# EAGLE design Atomic_Stick (EAGLE 9.6.2)
Assembly variants: ECU Type I non terminated

## Sheet 1 of 3
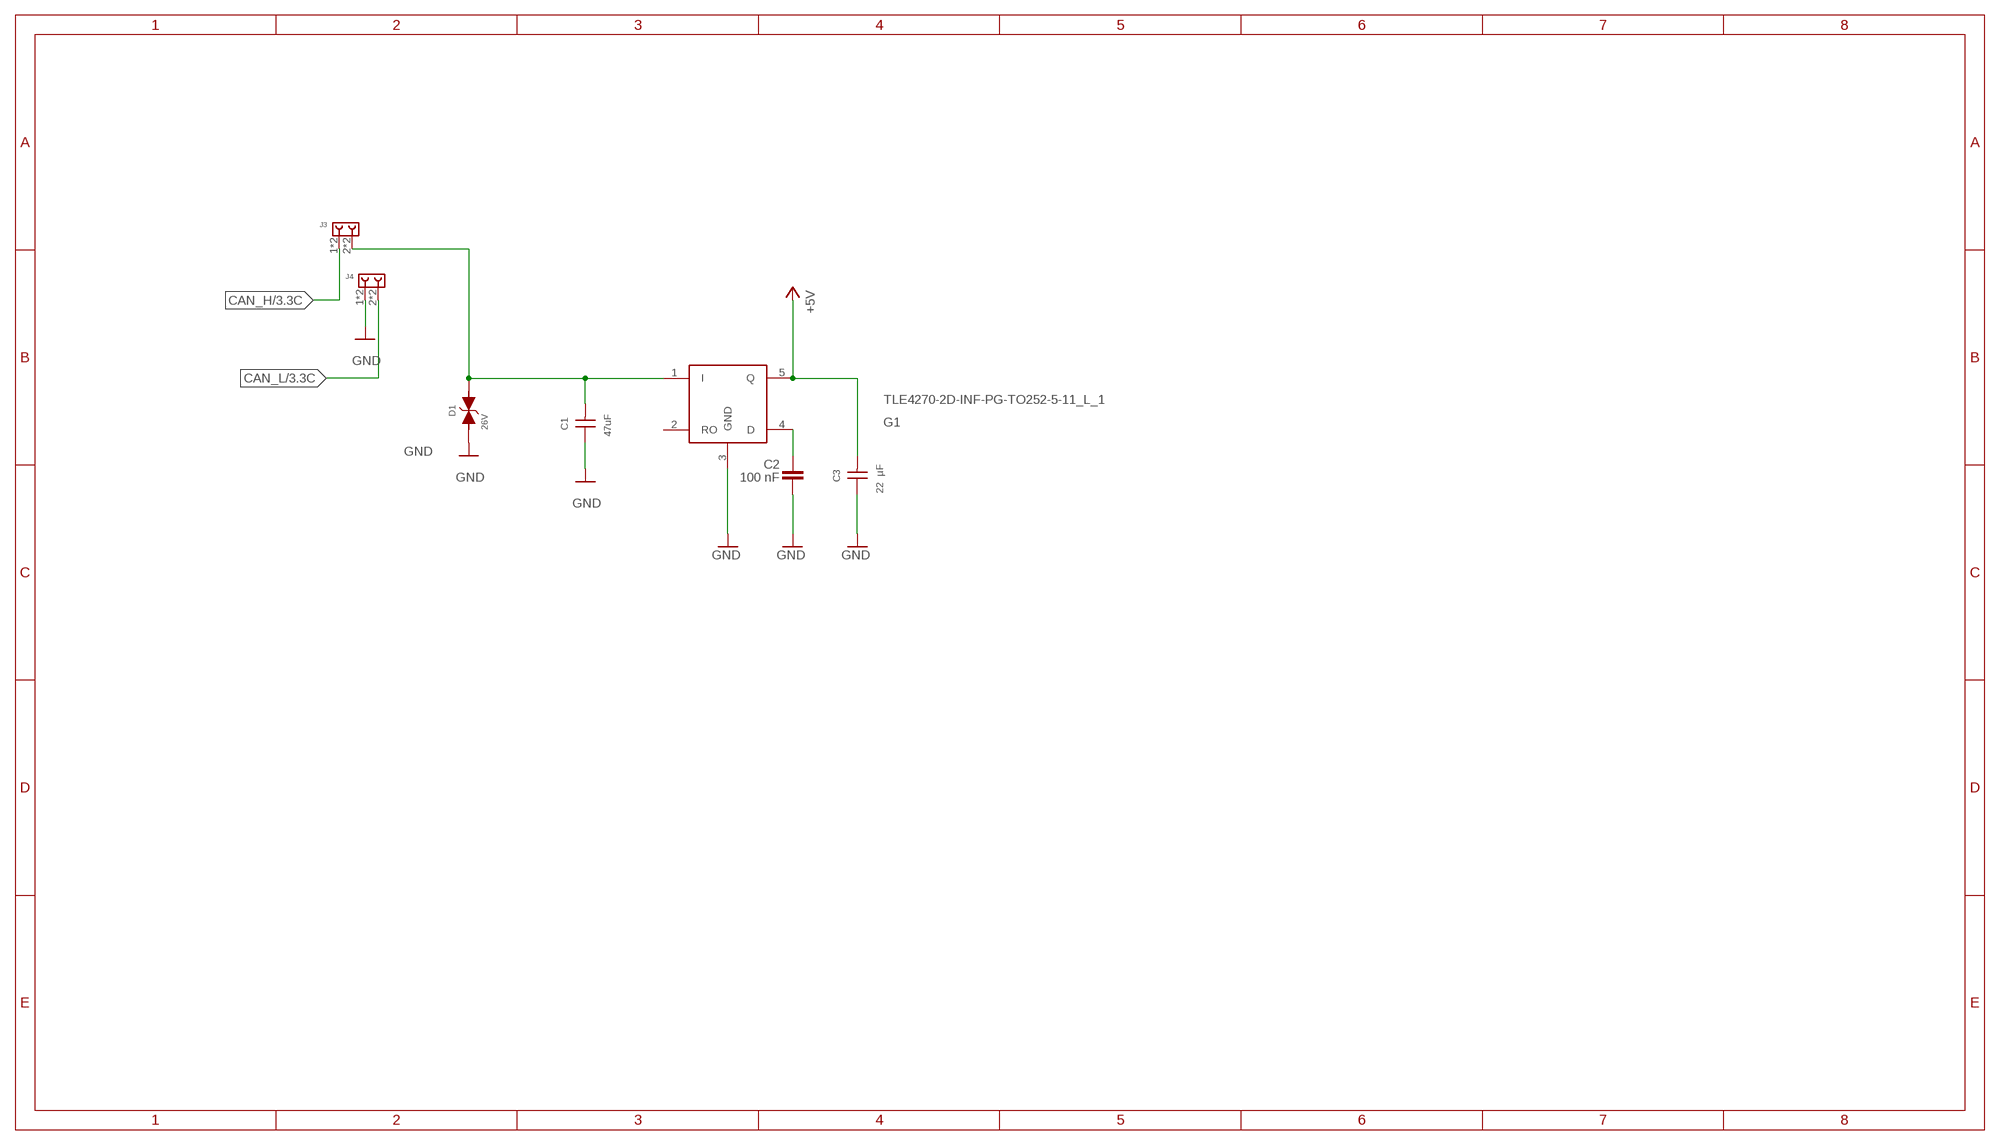
[diagram p0: schematic, sheet 1]

### Parts
C1  47uF  WCAP-CSGP_1210_H2.5_885012109014_25V(DC)  [WCAP-CSGP_1210_H2.5]
C2  100 nF  WCAP-CSGP_0402_885012205037_16V(DC)  [WCAP-CSGP_0402]
C3  22 µF  WCAP-CSGP_0805_H1.25_885012107011_10V(DC)  [WCAP-CSGP_0805_H1.25_R]
D1  26V  WE-TVSP_DO-214AC_400W_BI_824501261  [WE-TVSP_DO-214AC_BIDIRECTIONAL]
G1  TLE4270-2D-INF-PG-TO252-5-11_L_1  [INF-PG-TO252-5-11_L_1PRIMARY]
J3  695402400222  [695402400222]
J4  695402400222  [695402400222]

### Nets
+5V: C3.2 G1.5(Q) ; also sheet 2,3
+12V: C1.2 D1.2 G1.1(I) J3.2 J3.A2
CAN_H: J3.1 J3.A1 ; also sheet 3
CAN_L: J4.2 J4.A2 ; also sheet 3
GND [GND]: C1.1 C2.2 C3.1 D1.1 G1.3(GND) J4.1 J4.A1 ; also sheet 2,3
N$1: C2.1 G1.4(D)
Unconnected: G1.2(RO)

## Sheet 2 of 3
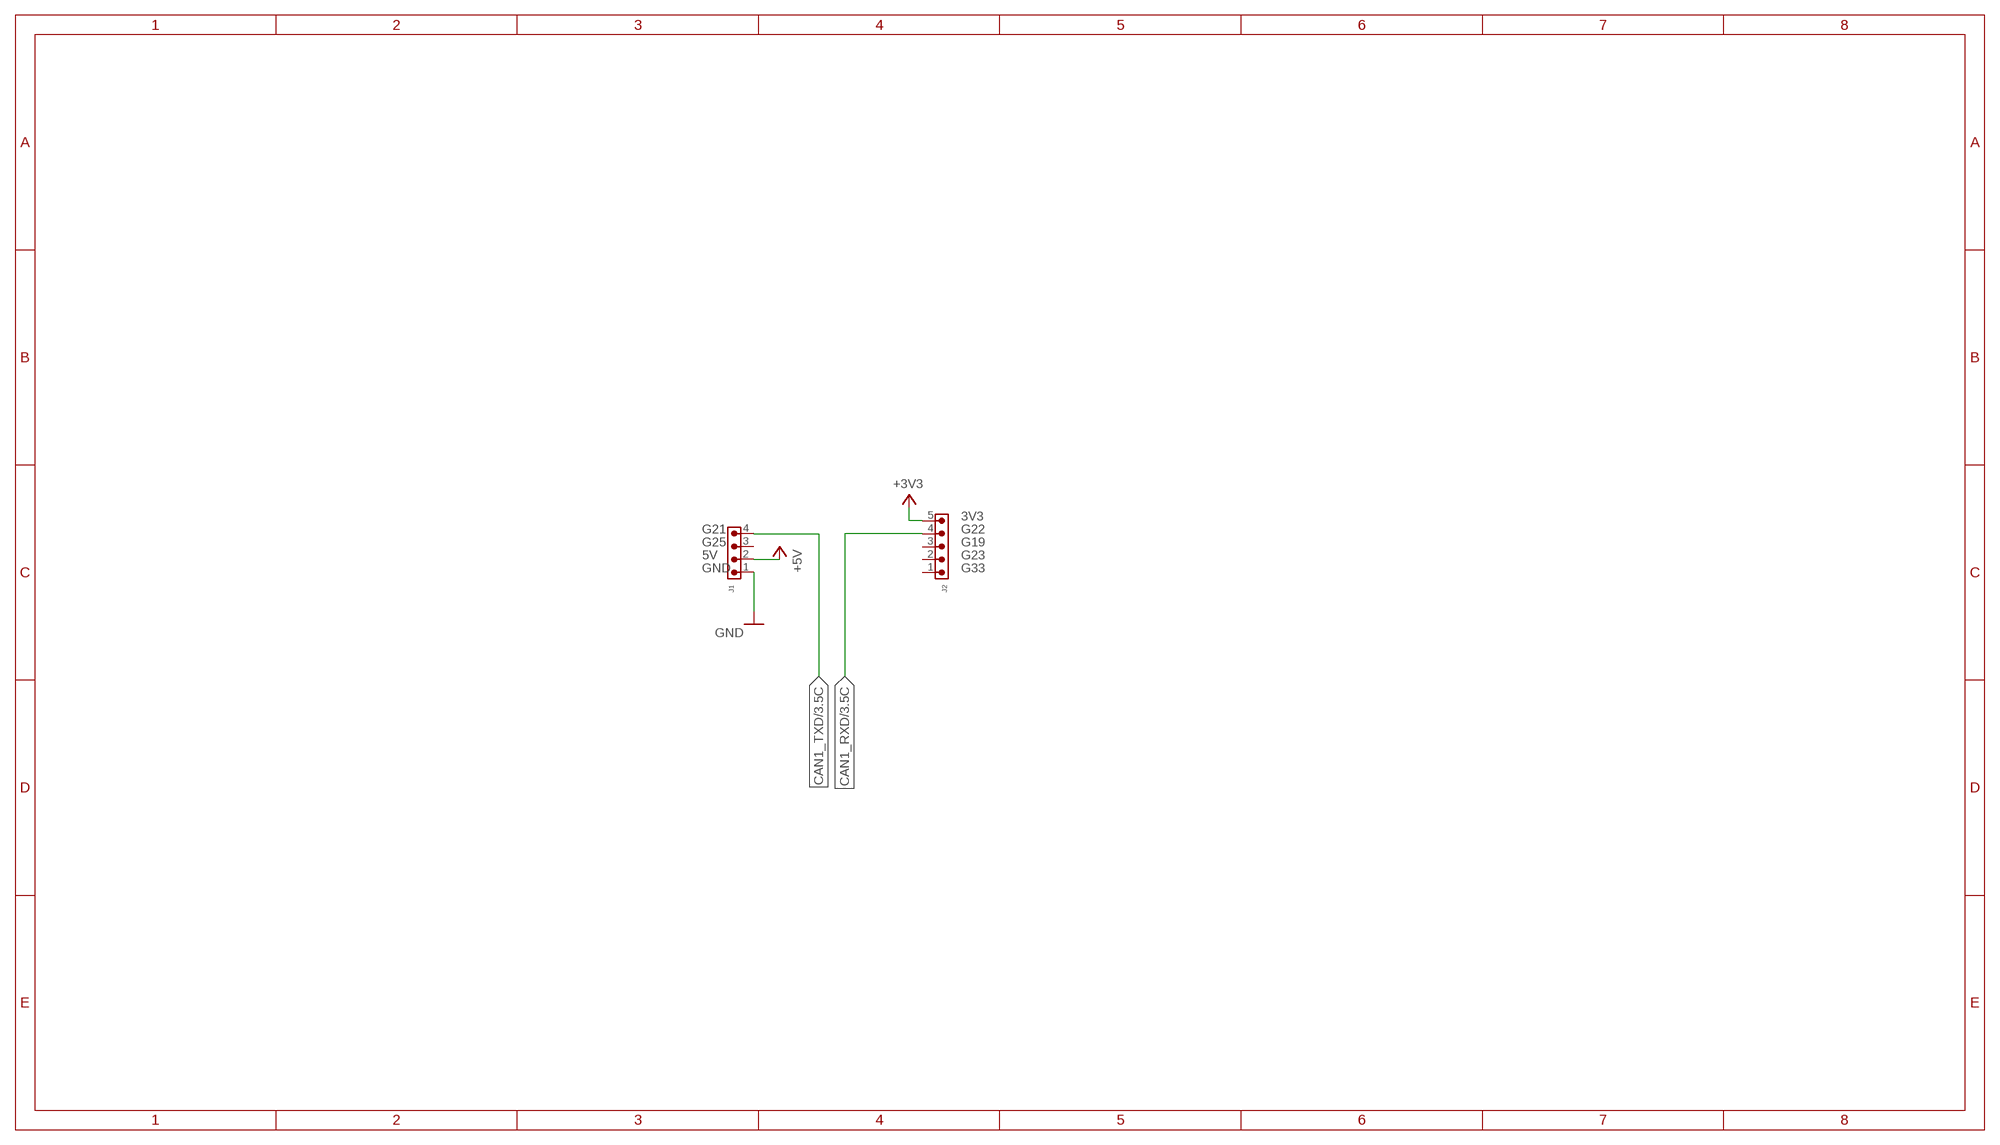
[diagram p1: schematic, sheet 2]

### Parts
J1  6130XX11121_61300411121  [61300411121]
J2  6130XX11121_61300511121  [61300511121]

### Nets
+3V3: J2.5 ; also sheet 3
+5V: J1.2 ; also sheet 1,3
CAN1_RXD: J2.4 ; also sheet 3
CAN1_TXD: J1.4 ; also sheet 3
GND [GND]: J1.1 ; also sheet 1,3
Unconnected: J1.3 J2.1 J2.2 J2.3

### Notes on the sheet
- 3V3
- G21 | G22
- G25 | G19
- 5V | G23
- GND | G33

## Sheet 3 of 3
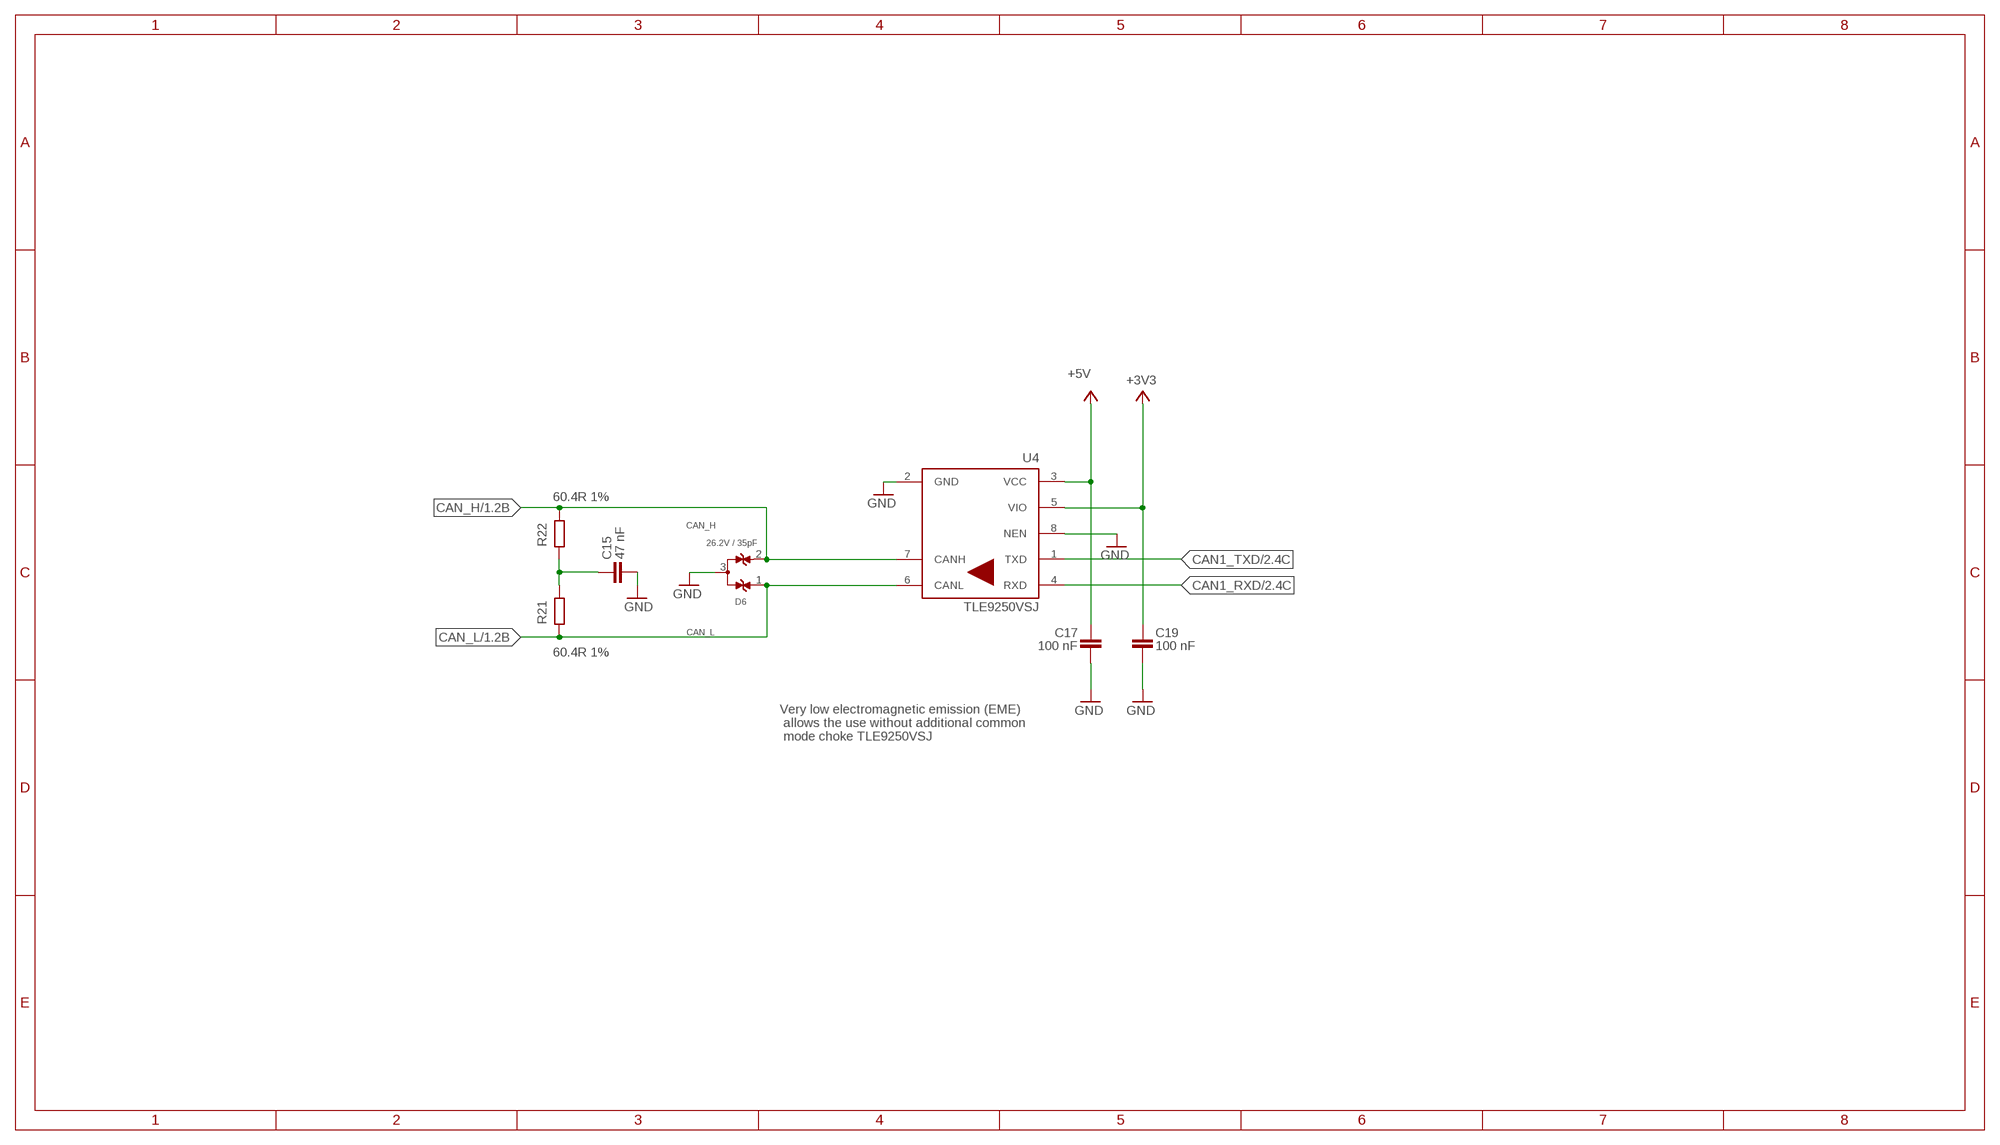
[diagram p2: schematic, sheet 3]

### Parts
C15  47 nF  WCAP-CSGP_0402_885012205054_25V(DC)  [WCAP-CSGP_0402]
C17  100 nF  WCAP-CSGP_0402_885012205037_16V(DC)  [WCAP-CSGP_0402]
C19  100 nF  WCAP-CSGP_0402_885012205037_16V(DC)  [WCAP-CSGP_0402]
D6  26.2V / 35pF  WE-TVS_SOT23-3L_824098024  [WE-TVS_SOT23-3L]
R21  60.4R 1%  R-0402_60.4OHMS_1%_AEC-Q200  [WCAP-CSRF_0402]  (not fitted in variant ECU Type I non terminated)
R22  60.4R 1%  R-0402_60.4OHMS_1%_AEC-Q200  [WCAP-CSRF_0402]  (not fitted in variant ECU Type I non terminated)
U4  TLE9250VSJ  [SOIC127P602X173-8N-V]

### Nets
+3V3: C19.1 U4.5(VIO) ; also sheet 2
+5V: C17.1 U4.3(VCC) ; also sheet 1,2
CAN1_RXD: U4.4(RXD) ; also sheet 2
CAN1_TXD: U4.1(TXD) ; also sheet 2
CAN_H: D6.2 R22.2 U4.7(CANH) ; also sheet 1
CAN_L: D6.1 R21.1 U4.6(CANL) ; also sheet 1
GND [GND]: C15.2 C17.2 C19.2 D6.3 U4.2(GND) U4.8(NEN) ; also sheet 1,2
N$17: C15.1 R21.2 R22.1

### Notes on the sheet
- Very low electromagnetic emission (EME)
   allows the use without additional common
   mode choke TLE9250VSJ

## Library data of the parts
C1 = Wurth_Capacitors_WCAP-CSGP:WCAP-CSGP_1210_H2.5: WCAP-CSGP MLCCs 1210 General Purpose Characteristics General purpose product series High performance ceramic High electrical precision and stability ceramic especially for NP0 Minimal aging especially for NP0 Mounting style: SMT-Chip Ceramic: NP0 (Class I), X5R (Class II), X7R (Class II) Capacitance range: 22 pF ‒ 100 µF Temperature Coefficient: ±30 ppm/°C; ±0.54 % for NP0 ±15 % for X7R and X5R Voltage range (UR): 6.3 ‒ 100 V(DC) Operating temperature: -55 °C up to + 125 °C for NP0 and X7R -55 °C up to + 85 °C for X5R Termination: Cu/Ni/Sn Recommended soldering: Reflow soldering Applications Temperature compensation (NP0) Coupling Decoupling Bypass Smoothing Filtering Resonant circuit <https://www.we-online.com/catalog/media/o166502v209%20Family_WE-MLCC_1210.jpg> Details see: https://www.we-online.com/catalog/en/WCAP-CSGP-1210/ Updated by yingchun,Shan;2020-03-09 2020(C) Würth Elektronik; CERAMIC-TYPE: X5R Class II; DATASHEET-URL: https://www.we-online.com/catalog/datasheet/885012109014.pdf; DF: 0.05; H: 2.5mm; OPERATING-TEMPERATURE: -55 °C up to +85 °C; PART-NUMBER: 885012109014; QMIN: -; RISO: 0,005G Ohm; TECHNICAL-REFERENCE: X5R1210226M025DFCT10000; TOL-VALUE: ±20%; VALUE: 22µF; VR: 25V(DC)
C2 C17 C19 = fliegl-wuerth:WCAP-CSGP_0402: WCAP-CSGP MLCCs 0402 General Purpose Characteristics High performance ceramic High electrical precision and stability ceramic especially for NP0 Minimal aging especially for NP0 Mounting style: SMT-Chip Ceramic: NP0 (Class I), X5R (Class II), X7R (Class II) Capacitance range: 1 pF ‒ 10 µF Temperature Coefficient: ±30 ppm/°C; ±0.54 % for NP0 ±15 % for X5R and X7R Voltage range (UR): 6.3 ‒ 100 V(DC) Operating temperature: -55 °C up to + 125 °C for NP0 and X7R -55 °C up to + 85 °C for X5R Termination: Cu/Ni/Sn Recommended soldering: Reflow soldering Applications Temperature compensation (NP0) Coupling Decoupling Bypass Smoothing Filtering Resonant circuit <https://www.we-online.com/catalog/media/o157810v209%20Family_WE-MLCC_0805_weiss.jpg> Details see: https://www.we-online.com/catalog/en/WCAP-CSGP-0402/ Updated by yingchun,Shan;2020-03-06 2020(C) Würth Elektronik; ARTIKEL_NR: 545504; CERAMIC-TYPE: X7R Class II; PART-NUMBER: 885012205037; TOL-VALUE: ±10%; VR: 16V(DC)
C3 = Wurth_Capacitors_WCAP-CSGP:WCAP-CSGP_0805_H1.25: WCAP-CSGP MLCCs 0805 General Purpose Characteristics General purpose product series High performance ceramic High electrical precision and stability ceramic especially for NP0 Minimal aging especially for NP0 Mounting style: SMT-Chip Ceramic: NP0 (Class I), X5R (Class II), X7R (Class II) Capacitance range: 1 pF ‒ 47 μF Temperature Coefficient: ±30 ppm/°C; ±0.54 % for NP0 ±15 % for X7R and X5R Voltage range (UR): 6.3 ‒ 100 V(DC) Operating temperature: -55 °C up to + 125 °C for NP0 and X7R -55 °C up to + 85 °C for X5R Termination: Cu/Ni/Sn Recommended soldering: Reflow soldering Wave soldering (only valid for the thickness ≤1.00 mm) for NP0 and X7R Applications TTemperature compensation (NP0) Coupling Decoupling Bypass Smoothing Filtering Resonant circuit <https://www.we-online.com/catalog/media/o166500v209%20Family_WE-MLCC_0805_grau.jpg> Details see: https://www.we-online.com/catalog/en/WCAP-CSGP-0805/ Updated by yingchun,Shan;2020-03-09 2020(C) Würth Elektronik; CERAMIC-TYPE: X5R Class II; DATASHEET-URL: https://www.we-online.com/catalog/datasheet/885012107011.pdf; DF: 0.1; H: 1.25mm; OPERATING-TEMPERATURE: -55 °C up to +85 °C; PART-NUMBER: 885012107011; QMIN: -; RISO: 0,005GOhm; TECHNICAL-REFERENCE: X5R0805226M010DFCT10000; TOL-VALUE: ±20%; VR: 10V(DC)
C15 = fliegl-wuerth:WCAP-CSGP_0402: WCAP-CSGP MLCCs 0402 General Purpose Characteristics High performance ceramic High electrical precision and stability ceramic especially for NP0 Minimal aging especially for NP0 Mounting style: SMT-Chip Ceramic: NP0 (Class I), X5R (Class II), X7R (Class II) Capacitance range: 1 pF ‒ 10 µF Temperature Coefficient: ±30 ppm/°C; ±0.54 % for NP0 ±15 % for X5R and X7R Voltage range (UR): 6.3 ‒ 100 V(DC) Operating temperature: -55 °C up to + 125 °C for NP0 and X7R -55 °C up to + 85 °C for X5R Termination: Cu/Ni/Sn Recommended soldering: Reflow soldering Applications Temperature compensation (NP0) Coupling Decoupling Bypass Smoothing Filtering Resonant circuit <https://www.we-online.com/catalog/media/o157810v209%20Family_WE-MLCC_0805_weiss.jpg> Details see: https://www.we-online.com/catalog/en/WCAP-CSGP-0402/ Updated by yingchun,Shan;2020-03-06 2020(C) Würth Elektronik; ARTIKEL_NR: 545508; CERAMIC-TYPE: X7R Class II; PART-NUMBER: 885012205054; TOL-VALUE: ±10%; VR: 25V(DC)
D1 = Wurth_EMC Components_WE-TVSP:WE-TVSP_DO-214AC_400W_BI: WE-TVSP Power TVS Diode Characteristics Low Profile Package Glass passivated Juction Excellent clamping capability Fast response time MSL Level 1, per J-STD-020 Classification of the plastic case: UL 94 V-0 Safety certification UL 497B, E478010 Identical design: - DO-214AC = SMAJ - DO-214AA = SMBJ - DO-214AB = SMCJ/SMDJ Applications Ideal to protect the I/O Interfaces, Bus Voltage and other circuits of sensetive electronic equipment against voltage transiensts <https://katalog.we-online.com/media/images/v2/o55793v209%20WE-TVSP_600W-3000W_D0214AA_4C.jpg> Details see: https://katalog.we-online.com/en/pbs/WE-TVSP Updated by Ella Wu 2019-07-05 2019 (C) Würth Elektronik; DATASHEET-URL: https://katalog.we-online.com/pbs/datasheet/824501261.pdf; IPEAK: 9.5A; MOUNT: SMT; PART-NUMBER: 824501261; PDISS: 400W; VBR: 30.4V; VCLAMP: 42.1V
D6 = fliegl-wuerth:WE-TVS_SOT23-3L_824098024: WE-TVS TVS Diode  Standard Series Characteristics Fast turn-on Low clamping voltage High ESD withstand voltage Uni- or bidirectional protection Small package Epoxy flame resistant UL94 V-0 Applications DC power supply USB Power Delivery (PD) Headsets and accessories PDAs Digital cameras MP3-Player Touch Panels Notebooks ESD, EFT and Surge Protection ESD protection in accordance with EN 61000-4-2  8 kV contact discharge  15 kV air discharge Application Notes ANP024 The USB Interface from EMC Point of View <https://katalog.we-online.de/media/images/v2/Family_WE-TVS_Standard.jpg> Details see: https://katalog.we-online.de/en/pbs/WE-TVS/82402374?m Created By Yingchun,Shan 2018-11-16 2018 (C) Wurth Elektronik; ARTIKEL_NR: 531887; KOMPONENTENNUMMER: 617684; WE-NUMBER: 824098024
G1 = INF-PG-TO252-5-11L:TLE4270-2D-INF-PG-TO252-5-11_L_1
J1 = Wurth_Connectors_WR-PHD:6130XX11121_61300411121: WR-PHD 2.54 mm THT Pin Header ARTICLE PROPERTIES: Pins:1;​ 2;​ 3;​ 4;​ 5;​ 6;​ 7;​ 8;​ 9;​ 10;​ 12;​ 13;​ 14;​ 15;​ 16;​ 18;​ 20;​ 22;​ 24;​ 25;​ 32;​ 36;​ 40 KIND PROPERTIES: Pitch：2.54 mm Quality Class:3 as per CECC 75 301-802 Rows：Single Gender：Pin Header Type：Straight MATERIAL PROPERTIES: Insulator Material :PBT Insulator Flammability Rating:UL94 V-0 Contact Material:Copper Alloy Contact Plating:Gold Contact Type:Stamped GENERAL INFORMATION Operating Temperature:-40 up to +105 °C Compliance:RoHS ELECTRICAL PROPERTIES: Rated Current:3 A IR 1:3 A Withstanding Voltage:500 V (AC) Contact Resistance:20 mΩ RISO:1000 MΩ CERTIFICATION UL Approval:E323964 PACKAGING PROPERTIES Packaging:Bag <https://katalog.we-online.com/media/images/v2/o33211v209%20Family_BTB_PHD_6130xx11121.jpg> Details see: https://katalog.we-online.com/en/em/PHD_2_54_THT_PIN_HEADER_6130XX11121 Updated by Yingchun,Shan 2019-10-16 2019 (C) Würth Elektronik; DATASHEET-URL: https://katalog.we-online.com/em/datasheet/61300411121.pdf; GENDER: Pin Header; IR: 3A; MATES: WR-PHD 2.54mm Angled Socket Header /SMT Socket Header/Socket Header; PACKAGING: Bag; PART-NUMBER: 61300411121; PINS: 4; ROWS: Single; TYPE: Straight
J2 = Wurth_Connectors_WR-PHD:6130XX11121_61300511121: WR-PHD 2.54 mm THT Pin Header ARTICLE PROPERTIES: Pins:1;​ 2;​ 3;​ 4;​ 5;​ 6;​ 7;​ 8;​ 9;​ 10;​ 12;​ 13;​ 14;​ 15;​ 16;​ 18;​ 20;​ 22;​ 24;​ 25;​ 32;​ 36;​ 40 KIND PROPERTIES: Pitch：2.54 mm Quality Class:3 as per CECC 75 301-802 Rows：Single Gender：Pin Header Type：Straight MATERIAL PROPERTIES: Insulator Material :PBT Insulator Flammability Rating:UL94 V-0 Contact Material:Copper Alloy Contact Plating:Gold Contact Type:Stamped GENERAL INFORMATION Operating Temperature:-40 up to +105 °C Compliance:RoHS ELECTRICAL PROPERTIES: Rated Current:3 A IR 1:3 A Withstanding Voltage:500 V (AC) Contact Resistance:20 mΩ RISO:1000 MΩ CERTIFICATION UL Approval:E323964 PACKAGING PROPERTIES Packaging:Bag <https://katalog.we-online.com/media/images/v2/o33211v209%20Family_BTB_PHD_6130xx11121.jpg> Details see: https://katalog.we-online.com/en/em/PHD_2_54_THT_PIN_HEADER_6130XX11121 Updated by Yingchun,Shan 2019-10-16 2019 (C) Würth Elektronik; DATASHEET-URL: https://katalog.we-online.com/em/datasheet/61300511121.pdf; GENDER: Pin Header; IR: 3A; MATES: WR-PHD 2.54mm Angled Socket Header /SMT Socket Header/Socket Header; PACKAGING: Bag; PART-NUMBER: 61300511121; PINS: 5; ROWS: Single; TYPE: Straight
J3 J4 = Wurth_Connectors_WR-LECO:695402400222: WR-LECO 4.00 mm SMT Horizontal Connector CERTIFICATION UL Approval E323964 WIREPROPERTIES Solid Wire Section (AWG) 18 to 24 (AWG) Solid Wire Section (Metric) 0.823 to 0.205 (mm²) Stranded Wire Section (AWG) 18 to 24 (AWG) Stranded Wire Section (Metric) 0.823 to 0.205 (mm²) Wire Strip Length 8 up to 9 (mm) ELECTRICAL PROPERTIES Working Voltage [UL] 250 V (AC) Withstanding Voltage [UL] 1500 V (AC) Contact Resistance [UL] 20 mΩ GENERAL INFORMATION Operating Temperature -35 °C up to +105 °C Compliance Lead free / RoHS IR UL 9 A MATERIAL PROPERTIES Insulator Material PPA-GF Insulator Flammability Rating UL94 V-0 Insulator Color Grey Contact Material Copper Alloy Contact Plating Tin over Nickel KIND PROPERTIES Pitch 4 mm <https://katalog.we-online.com/media/images/v2/o79410v209%20WR-LECO_6954xx400222_4C.jpg> Details see: https://katalog.we-online.com/en/em/LECO_4_00_SMT_WTB_CONNECTOR_HORIZONTAL_6954XX400222 Updated by Ella Wu 2019-10-30 2019(C) Wurth Elektronik; DATASHEET-URL: https://katalog.we-online.com/em/datasheet/695402400222.pdf; GENDER: Wire to Board; IR: 9A; PART-NUMBER: 695402400222; PINS: 2; PITCH: 4mm; TYPE: Angled; WORKING-VOLTAGE: 250V(AC)
R21 R22 = Resistor_smaller_fliegl:R-0402_: RESISTOR, European symbol; ARTIKEL_NR: 546940; N: SMD 0402 60.4ohms 1% AEC-Q200
U4 = TLE9250VSJ:TLE9250VSJ: TLE9250VSJ SOIC127P602X173-8N-V High Speed CAN FD Transceiver; ARTIKEL_NR: 545599

## Net classes
1 GND: width 0.127 mm, clearance 0.127 mm to class 0

## Board
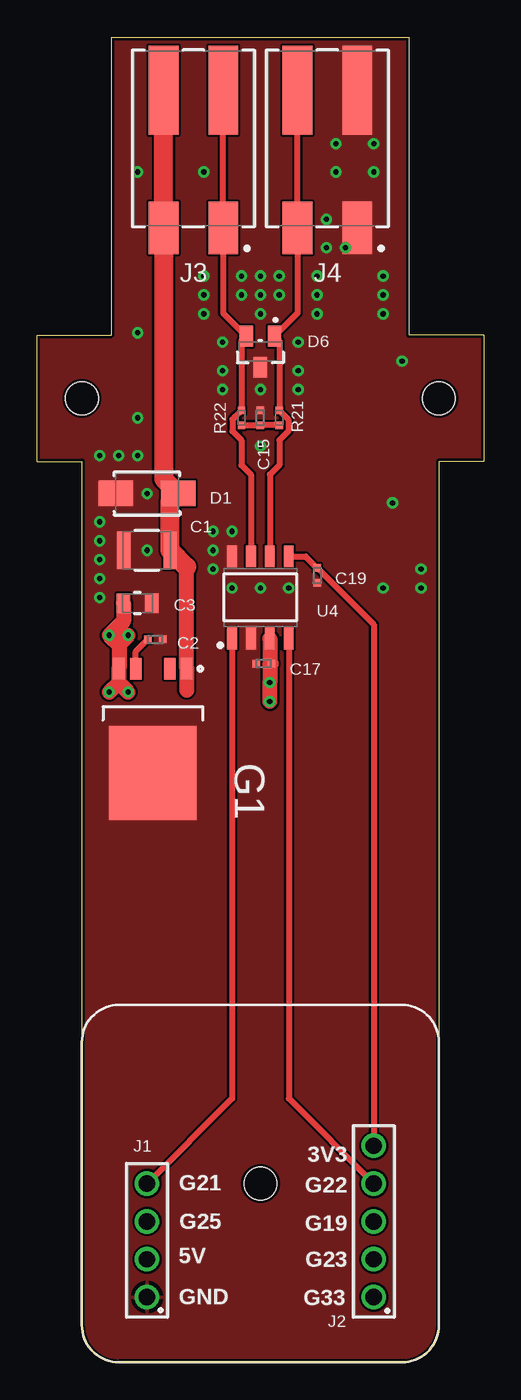
[diagram p3: board, top side]
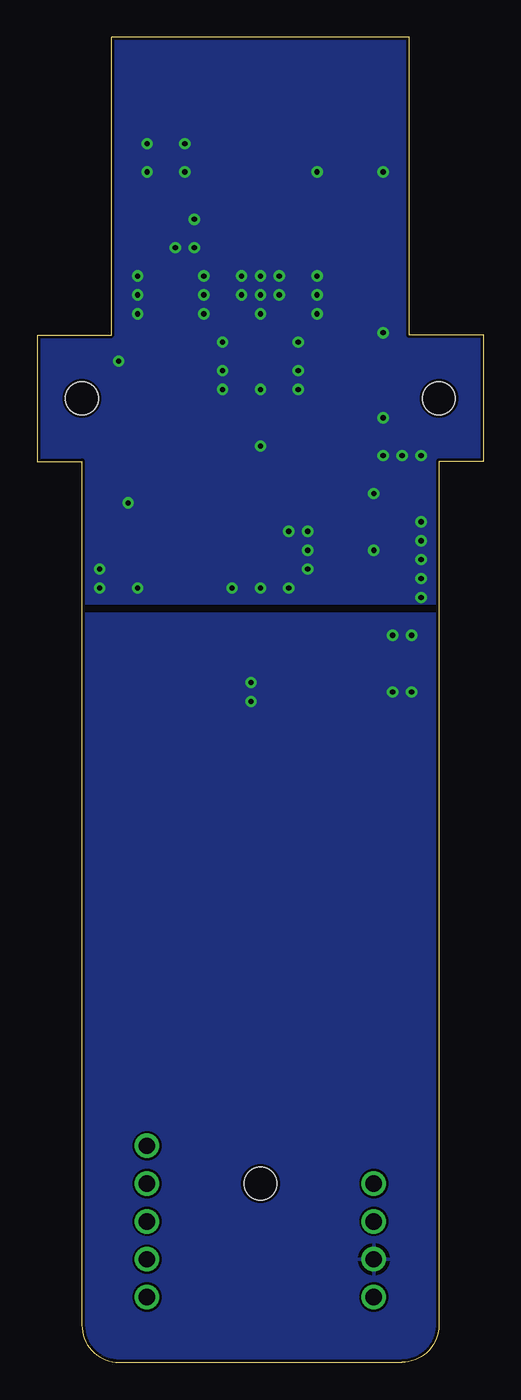
[diagram p4: board, bottom side, seen from below]

Size 30 x 89 mm. Coordinates in mm from the lower left corner, seen from the top.
Outline: 0,69 5,69 5,89 25,89 25,69 30,69 30,60.5 27,60.5 27,2.5 arc-90 24.5,0 5.5,0 arc-90 3,2.5 3,60.5 0,60.5 0,69
Copper layers (1*16): Top 0.035mm / dielectric 1.5mm / Bottom 0.035mm
Design rules "default *": minimum track width 6mil, minimum drill 0.3mm, track to track 6mil, track to pad 6mil, pad to pad 6mil, via to via 6mil, smd to smd 6mil, copper to edge 0.2mm, drill to drill 6mil, minimum pad ring 10mil, minimum via ring 8mil, stop-mask expansion 4mil, vias tented up to drill 0.4mm, thermal gap 10mil
Holes 2.2 mm at 15,12 3,64.75 27,64.75

### Footprints (pad centres in the part's own frame; a part is rotated, then mirrored left to right if it is on the bottom)
WCAP-CSGP_1210_H2.5 = smd 0.9 x 2.5: 1 -1.55,0; 2 1.55,0
WCAP-CSGP_0402 = smd 0.5 x 0.5: 1 -0.5,0; 2 0.5,0
WCAP-CSGP_0805_H1.25_R = smd 0.9 x 1.3: 1 -0.95,0; 2 0.95,0
WE-TVSP_DO-214AC_BIDIRECTIONAL = smd 2.3 x 1.7: 1 -2.1,0; 2 2.1,0
WE-TVS_SOT23-3L = smd 1.4 x 0.9: 1 -1.05,0.95; 2 -1.05,-0.95; 3 1.05,0
INF-PG-TO252-5-11_L_1PRIMARY = smd 1.45 x 0.75: 1 -4.7,2.28; 2 -4.7,1.14; 4 -4.7,-1.14; 5 -4.7,-2.28 | smd 6.3 x 5.85: 3 2.3,0
61300411121 = drill 1.1: 1 -3.81,0; 2 -1.27,0; 3 1.27,0; 4 3.81,0
61300511121 = drill 1.1: 1 -5.08,0; 2 -2.54,0; 3 0,0; 4 2.54,0; 5 5.08,0
695402400222 = smd 2 x 3.5: 1 -2,4.625; 2 2,4.625 | smd 2 x 6: A1 -2,-4.625; A2 2,-4.625
WCAP-CSRF_0402 = smd 0.5 x 0.5: 1 0.5,0; 2 -0.5,0
SOIC127P602X173-8N-V = smd 1.47 x 0.65: 1 -2.765,1.905; 2 -2.765,0.635; 3 -2.765,-0.635; 4 -2.765,-1.905; 5 2.765,-1.905; 6 2.765,-0.635; 7 2.765,0.635; 8 2.765,1.905

### Placement (x,y rotation side)
C1  7.38,54.55 0 top
C2  7.94,48.55 0 top
C3  6.75,50.99 180 top
C15  15,63.44 90 top
C17  15.21,46.92 180 top
C19  18.81,52.85 270 top
D1  7.38,58.35 0 top
D6  15,67.88 270 top
G1  7.77,41.89 270 top
J1  7.38,8.19 90 top
J2  22.62,9.46 90 top
J3  10.5,80.82 180 top
J4  19.5,80.82 180 top
R21  16.27,63.44 90 top
R22  13.73,63.44 270 top
U4  15,51.37 90 top

### Tracks (layer width: path | path; a pad name or v marks a point on that pad's centre or on a via)
+3V3
  Top 0.406: U4.5 18.03,54.13 C19.1 19.2,52.96 19.21,52.96 22.62,49.55 J2.5
+5V  (via drill 0.35)
  Top 1: v6.11,48.83 5.49,48.21 G1.5 | G1.5 5.49,48.18 v4.84,48.83 5.8,49.79 C3.2 | v6.11,45.02 5.49,45.64 G1.5 | v4.84,45.02 5.49,45.67 G1.5 | U4.3 v15.63,45.66 | v15.63,44.38 v15.63,45.66 | C17.1 15.63,46.84 v15.63,45.66
  pour Bottom: 0,50.27 30,50.27 30,0 0,0
+12V
  Top 1: 10.05,53.42 G1.1 10.05,45.15
  Top 1.27: 10.05,53.42 C1.2 8.93,57.8 D1.2 8.5,59.34 J3.2 J3.A2
CAN1_RXD
  Top 0.406: U4.4 16.91,17.71 J2.4
CAN1_TXD
  Top 0.406: U4.1 13.1,17.71 J1.4
CAN_H
  Top 0.406: U4.7 14.37,59.62 13.73,60.26 13.73,61.93 13.12,62.54 13.12,63.33 13.33,63.54 13.34,63.54 R22.2 13.73,68.61 D6.2 12.5,70.48 J3.1 J3.A1
CAN_L
  Top 0.406: U4.6 15.63,59.62 16.27,60.26 16.27,61.93 16.88,62.54 16.88,63.33 16.67,63.54 16.66,63.54 R21.1 16.27,68.61 D6.1 17.5,70.48 J4.2 J4.A2
GND  (via drill 0.35)
  other vias: 15,71.69 4.21,51.37 4.21,52.64 4.21,53.91 4.21,55.18 15,61.53 15,65.34 17.54,68.52 12.46,68.52 12.46,66.61 17.54,66.61 17.54,65.34 12.46,65.34 4.21,56.45 4.21,60.9 5.47,60.9 6.74,60.9 18.81,70.42 18.81,71.69 18.81,72.96 23.26,72.96 23.26,71.69 23.26,70.42 11.19,72.96 11.19,71.69 11.19,70.42 13.73,71.69 13.73,72.96 15,72.96 16.27,72.96 16.27,71.69 15,70.42 22.62,79.94 20.08,79.94 20.08,81.85 22.62,81.85 19.45,76.77 19.45,74.87 13.1,55.81 11.82,55.81 11.82,54.55 11.82,53.27 7.38,54.55 7.38,58.35 25.8,52.01 25.8,53.27 23.26,52.01 16.91,52.01 15,52.01 13.1,52.01 20.71,74.87 6.74,63.44 6.74,69.15 6.74,79.94 11.19,79.94 24.52,67.25 23.89,57.72
  pour Top: 0,89 30,89 30,0 0,0
  pour Bottom: 0,89 30,89 30,51 0,51
N$1
  Top 0.406: G1.4 6.63,47.75 C2.1
N$17
  Top 0.406: R22.1 C15.1 R21.2

### Text on the board
tPlace: 3V3 | G21 | G22 | G25 | G19 | 5V | G23 | GND | G33